# EasyEDA Pro project Sabhya_USB_HUb.epro

# Schematic Schematic1
Board Name: Board1; Create Date: 2026-05-26; Page Name: P1; Project Name: Sabhya_USB_Hub; Schematic Name: Schematic1; Update Date: 2026-05-27; Company: EasyEDA.com; Page Size: A4; Version: V1.0
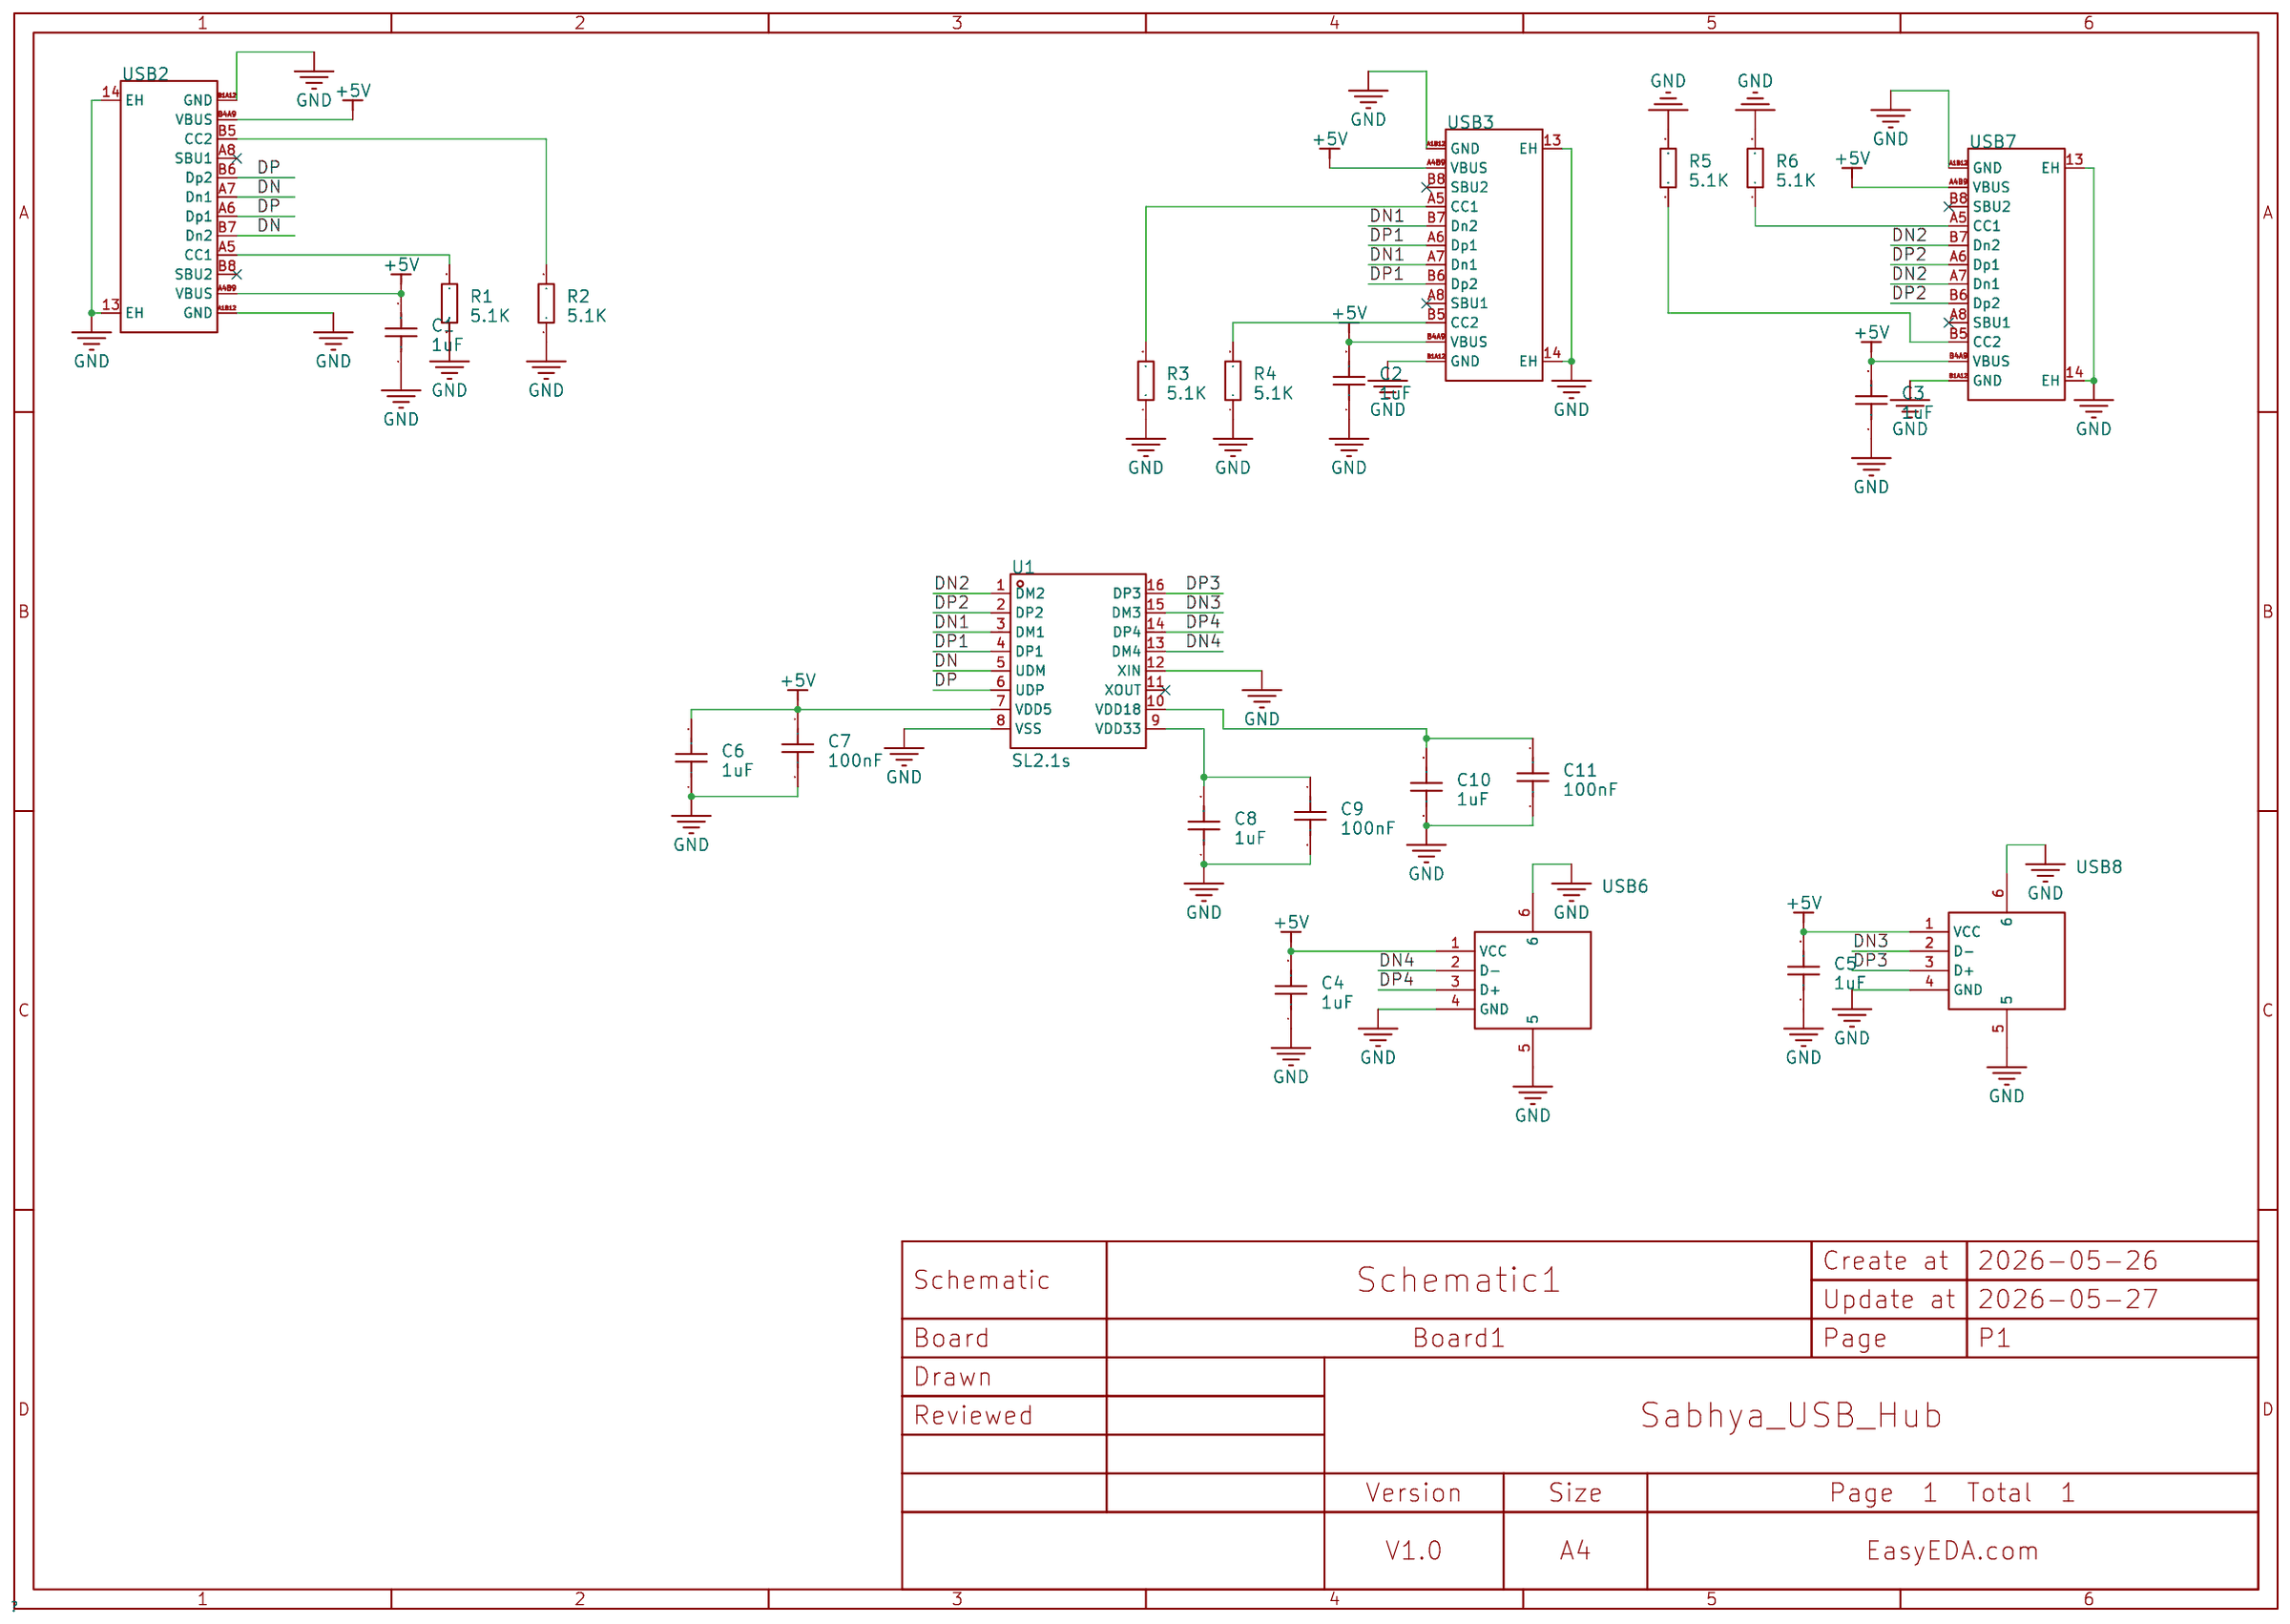
[diagram p0: schematic sheet]

## Parts
C1  1uF  [C0603]
C2  1uF  [C0603]
C3  1uF  [C0603]
C4  1uF  [C0603]
C5  1uF  [C0603]
C6  1uF  [C0603]
C7  100nF  [C0603]
C8  1uF  [C0603]
C9  100nF  [C0603]
C10  1uF  [C0603]
C11  100nF  [C0603]
R1  5.1K  [R0603]
R2  5.1K  [R0603]
R3  5.1K  [R0603]
R4  5.1K  [R0603]
R5  5.1K  [R0603]
R6  5.1K  [R0603]
U1  SL2.1s  [SSOP-16_L4.6-W2.6-P0.53-LS4.0-BL]
USB2  TYPE-C 16PIN 2MD(073)  [USB-C-SMD_TYPE-C-16PIN-2MD-073]
USB3  TYPE-C 16PIN 2MD(073)  [USB-C-SMD_TYPE-C-16PIN-2MD-073]
USB6  10.0 QHHTZB6.3  [USB-A-TH_10.0QHHTZB6.3]
USB7  TYPE-C 16PIN 2MD(073)  [USB-C-SMD_TYPE-C-16PIN-2MD-073]
USB8  10.0 QHHTZB6.3  [USB-A-TH_10.0QHHTZB6.3]

## Library data of the parts
C1-C6 C8 C10 = CAP_0603: Supplier Footprint: 0603; LCSC Part Name: 1uF ±10% 50V; Supplier Part: C15849; Manufacturer: SAMSUNG(三星); Manufacturer Part: CL10A105KB8NNNC; JLCPCB Part Class: Basic Part; Datasheet: https://item.szlcsc.com/datasheet/CL10A105KB8NNNC/16531.html; Supplier: LCSC; Tolerance: ±10%; Voltage Rating: 50V; Temperature Coefficient: X5R; PCB Layer: TopLayer
C7 C9 C11 = CAP_0603: Supplier Footprint: 0603; LCSC Part Name: CAPR500-350X720X850100nF100V; Supplier Part: C2927433; Manufacturer Part: CAPR500-350X720X850100nF100V; JLCPCB Part Class: Extended Part; Supplier: LCSC; PCB Layer: TopLayer
R1-R6 = Res_0603: Supplier Footprint: 0603
U1 = SL2.1s: type:Hub USB Protocol:USB 2.0 Data Rate:- Voltage - Supply:4V~5.25V Voltage - Supply:4V~5.25V Operating Temperature:0℃~+70℃ Operating Temperature:0℃~+70℃ Memory Interface:- Current - Supply:120mA Quiescent Supply Current:2.5mA Number of Channels:4; LCSC Part Name: USB2.0 HUB控制器集成电路; Supplier Part: C2684433; Manufacturer: CoreChips(和芯润德); Supplier Footprint: SSOP-16; JLCPCB Part Class: Extended Part; Datasheet: https://item.szlcsc.com/datasheet/SL2.1s/2782346.html; Supplier: LCSC; type: Hub; USB Protocol: USB 2.0; Voltage - Supply: 4V~5.25V; Operating Temperature: 0℃~+70℃; Current - Supply: 120mA; Quiescent Supply Current: 2.5mA; Number of Channels: 4
USB2 USB3 USB7 = TYPE-C 16PIN 2MD(073): Connector Type:Type-C Protocol Standard:- Gender:Female Mounting Type:Surface Mount, Right Angle Number of Contacts:16P Number of Ports:1 Current Rating-Power:3A Voltage Rating:5V Connect-Disconnect Life:10,000 Cycles Supplementary Features:- Center Heigh; LCSC Part Name: Type-C 母 卧贴; Supplier Part: C2765186; Manufacturer: SHOU HAN(首韩); Supplier Footprint: SMD; JLCPCB Part Class: Extended Part; Datasheet: https://item.szlcsc.com/datasheet/TYPE-C%252016PIN%25202MD(073)/2901843.html; Supplier: LCSC; Connector Type: Type-C; Gender: Female; Mounting Type: Surface Mount, Right Angle; Number of Contacts: 16P; Number of Ports: 1; Current Rating-Power: 3A; Voltage Rating: 5V; Connect-Disconnect Life: 10,000 Cycles; Detection color: Black; Operating Temperature: -25℃~+85℃
USB6 USB8 = 10.0 QHHTZB6.3: Connector Type:Type-A Protocol Standard:USB 2.0 Gender:Female Mounting Type:Surface Mount, Right Angle Number of Contacts:4P Number of Ports:1 Current Rating-Power:1.5A Voltage Rating:30V Connect-Disconnect Life:5,000 times Supplementary Features:- Center; LCSC Part Name: 壳长10.0mm; Supplier Part: C668591; Manufacturer: SHOU HAN(首韩); Supplier Footprint: SMD; JLCPCB Part Class: Extended Part; Datasheet: https://item.szlcsc.com/datasheet/10.0%2520QHHTZB6.3/698534.html; Supplier: LCSC; Connector Type: Type-A; Protocol Standard: USB 2.0; Gender: Female; Mounting Type: Surface Mount, Right Angle; Number of Contacts: 4P; Number of Ports: 1; Current Rating-Power: 1.5A; Voltage Rating: 30V; Connect-Disconnect Life: 5,000 times; Length: 10mm; Detection color: Black; Operating Temperature: -25℃~+85℃

## Nets
+5V: C1.2 C2.2 C3.2 C4.2 C5.2 C6.2 C7.1 U1.7(VDD5) USB2.A4B9(VBUS) USB2.B4A9(VBUS) USB3.A4B9(VBUS) USB3.B4A9(VBUS) USB6.1(VCC) USB7.A4B9(VBUS) USB7.B4A9(VBUS) USB8.1(VCC)
GND: C1.1 C2.1 C3.1 C4.1 C5.1 C6.1 C7.2 C8.1 C9.2 C10.1 C11.2 R1.1 R2.1 R3.1 R4.1 R5.2 R6.2 U1.8(VSS) U1.12(XIN) USB2.13(EH) USB2.14(EH) USB2.A1B12(GND) USB2.B1A12(GND) USB3.13(EH) USB3.14(EH) USB3.A1B12(GND) USB3.B1A12(GND) USB6.4(GND) USB6.5 USB6.6 USB7.13(EH) USB7.14(EH) USB7.A1B12(GND) USB7.B1A12(GND) USB8.4(GND) USB8.5 USB8.6
DN: U1.5(UDM) USB2.A7(Dn1) USB2.B7(Dn2)
DN1: U1.3(DM1) USB3.A7(Dn1) USB3.B7(Dn2)
DN2: U1.1(DM2) USB7.A7(Dn1) USB7.B7(Dn2)
DN3: U1.15(DM3) USB8.2(D-)
DN4: U1.13(DM4) USB6.2(D-)
DP: U1.6(UDP) USB2.A6(Dp1) USB2.B6(Dp2)
DP1: U1.4(DP1) USB3.A6(Dp1) USB3.B6(Dp2)
DP2: U1.2(DP2) USB7.A6(Dp1) USB7.B6(Dp2)
DP3: U1.16(DP3) USB8.3(D+)
DP4: U1.14(DP4) USB6.3(D+)
$1N1488: R1.2 USB2.A5(CC1)
$1N1504: R2.2 USB2.B5(CC2)
$1N2566: R5.1 USB7.B5(CC2)
$1N2571: R6.1 USB7.A5(CC1)
$1N3207: C8.2 C9.1 U1.9(VDD33)
$1N3292: C10.2 C11.1 U1.10(VDD18)
$1N3299: R4.2 USB3.B5(CC2)
$1N3300: R3.2 USB3.A5(CC1)

Not connected (* = marked no-connect by the designer): U1 11(XOUT)*; USB2 A8(SBU1)* B8(SBU2)*; USB3 A8(SBU1)* B8(SBU2)*; USB7 A8(SBU1)* B8(SBU2)*

# Board PCB1
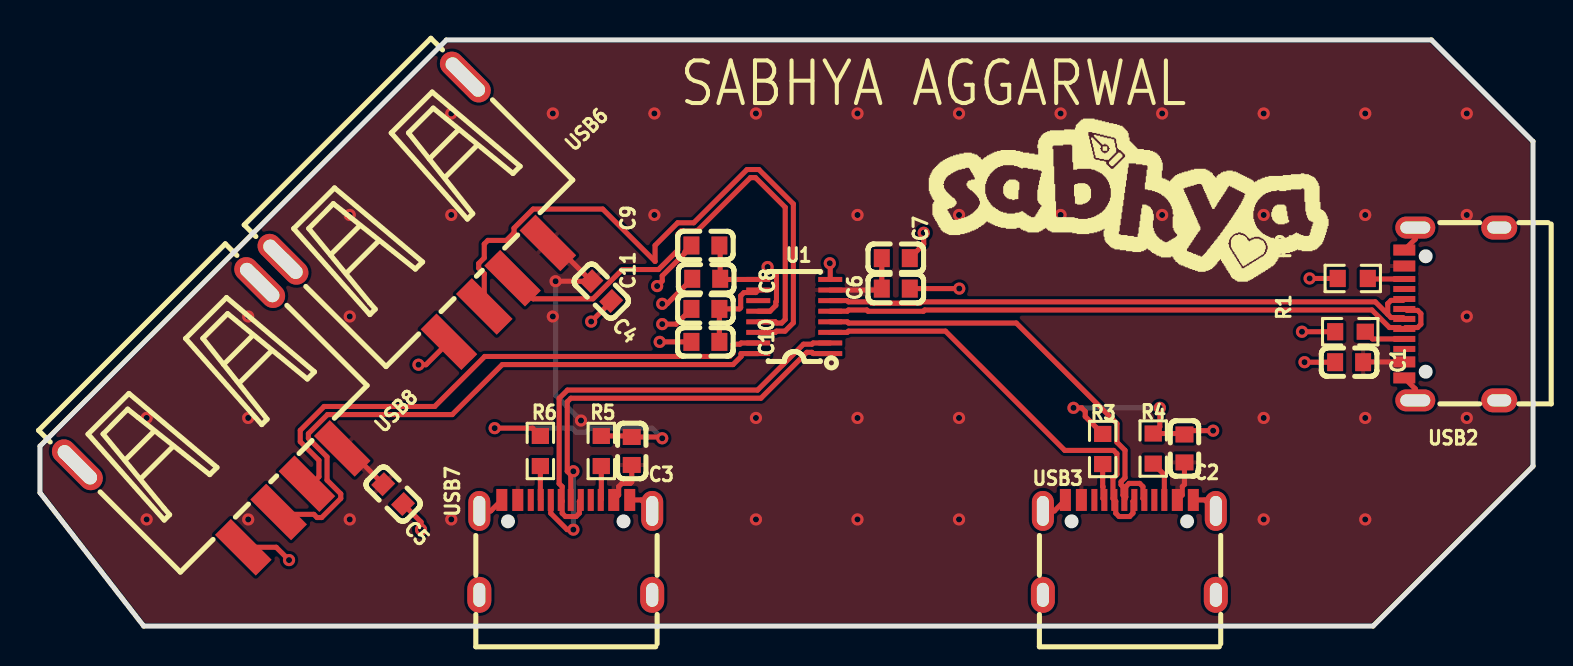
[diagram p1: board, top side]
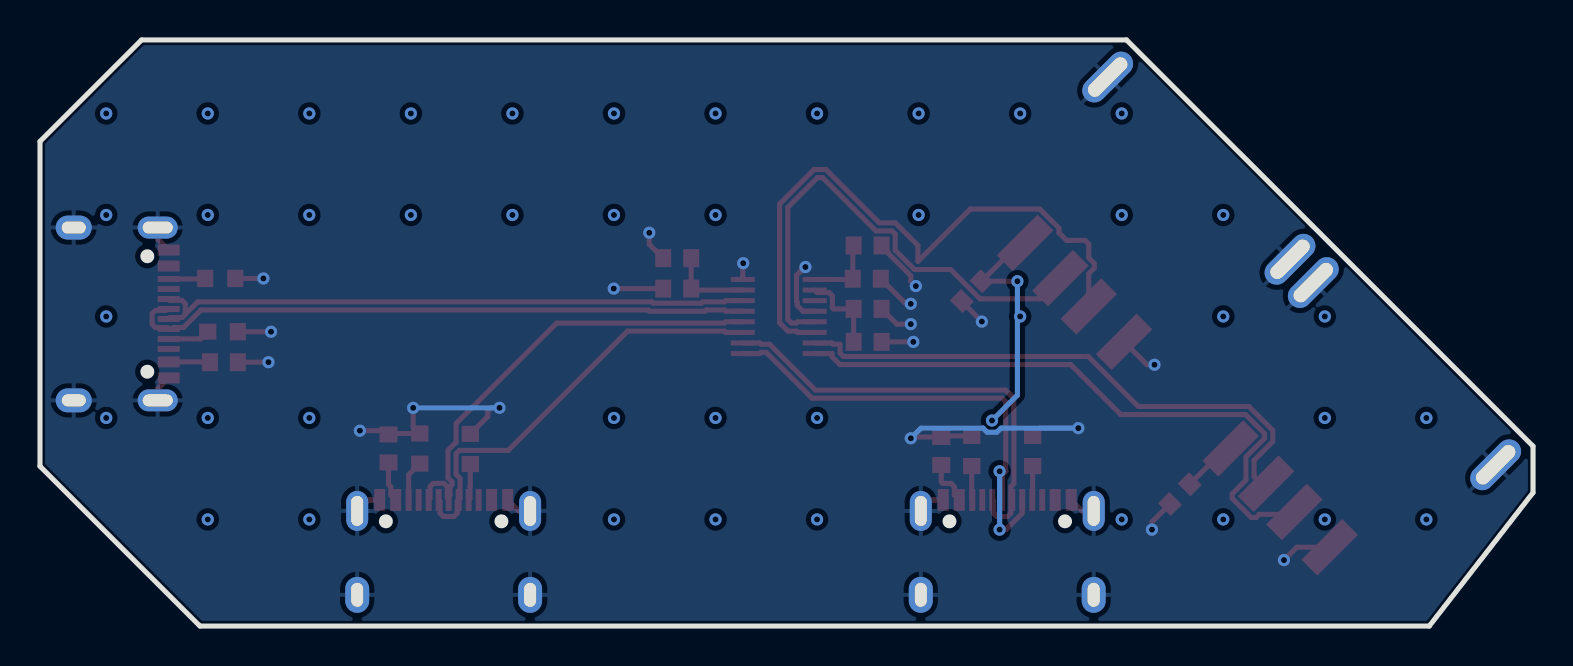
[diagram p2: board, bottom side, seen from below]

Outline 74.69 x 29.34 mm; copper layers: Top Layer, Bottom Layer. Coordinates in mm from the lower left corner of the outline.
Outline path: 0,9 0,6.68 5.19,0 66.69,0 74.69,8 74.69,24.26 69.61,29.34 20.33,29.34 0,9
Stack: Top Layer 0.035mm / Dielectric1 1.51mm FR4 er 4.5 / Bottom Layer 0.035mm

## Design rules (mm)
net DN2: DP3
net DP2: DP3
net DN1: DP2
net DP1: DP2
net DN: DP1
net DP: DP1
net DN4: DP5
net DP4: DP5
net DN3: DP4
net DP3: DP4
spacing copperThickness1oz (default): track to track 0.102, other pairs 0.152 to 0.3
spacing copperThickness2oz: track to track 0.203, other pairs 0.152 to 0.3
spacing Plane_innerPlane: track to track 0.102, other pairs 0.152 to 0.3
spacing Copper_copperRegion: track to track 0.102, other pairs 0.152 to 0.3
track width copperThickness1oz (default): min 0.127, default 0.254, max 2.54
track width copperThickness2oz: min 0.203, default 0.254, max 2.54
differential pair differentialPair (default): width min 0.127, default 0.254, max 2.54; gap min 0.152, default 0.152
pour e289 uses Copper_copperRegion
pour e320 uses Copper_copperRegion

## Placement (name value [footprint] x y rotation side)
C1  1uF  [C0603]  65.49 13.21 0 top
C2  1uF  [C0603]  57.25 8.89 270 top
C3  1uF  [C0603]  29.6 8.76 270 top
C4  1uF  [C0603]  28.08 16.76 135 top
C5  1uF  [C0603]  17.67 6.6 135 top
C6  1uF  [C0603]  42.81 16.89 180 top
C7  100nF  [C0603]  42.81 18.41 0 top
C8  1uF  [C0603]  33.33 17.38 0 top
C9  100nF  [C0603]  33.29 19.05 180 top
C10  1uF  [C0603]  33.29 14.22 0 top
C11  100nF  [C0603]  33.29 15.88 180 top
R1  5.1K  [R0603#2]  65.55 14.73 0 top
R2  5.1K  [R0603]  65.67 17.4 0 top
R3  5.1K  [R0603]  53.16 8.86 270 top
R4  5.1K  [R0603]  55.69 8.88 270 top
R5  5.1K  [R0603]  28.08 8.76 90 top
R6  5.1K  [R0603]  25.03 8.76 90 top
U1  SL2.1s  [SSOP-16_L4.6-W2.6-P0.53-LS4.0-BL]  37.73 15.49 90 top
USB2  TYPE-C 16PIN 2MD(073)  [USB-C-SMD_TYPE-C-16PIN-2MD-073]  70.63 15.62 90 top
USB3  TYPE-C 16PIN 2MD(073)  [USB-C-SMD_TYPE-C-16PIN-2MD-073]  54.5 3.94 0 top
USB6  10.0 QHHTZB6.3  [USB-A-TH_10.0QHHTZB6.3]  19.83 19.81 225 top
USB7  TYPE-C 16PIN 2MD(073)  [USB-C-SMD_TYPE-C-16PIN-2MD-073]  26.3 3.94 0 top
USB8  10.0 QHHTZB6.3  [USB-A-TH_10.0QHHTZB6.3]  9.54 9.52 225 top

## Footprints (pads in the part's own frame, mm; a bottom-side part is the same pattern mirrored in y, then rotated)
C0603
  rect 0.8x0.9 smd: 1(-0.7,0) 2(0.7,0)
R0603
  rect 0.806x0.864 smd: 1(-0.753,0) 2(0.753,0)
R0603#2
  rect 0.806x0.864 smd: 1(-0.753,0)
  rect 0.864x0.806 smd: 2(0.753,0)
SSOP-16_L4.6-W2.6-P0.53-LS4.0-BL
  rect 0.25x1.2 smd: 1(-1.855,-1.8) 2(-1.325,-1.8) 3(-0.795,-1.8) 4(-0.265,-1.8) 5(0.265,-1.8) 6(0.795,-1.8) 7(1.325,-1.8) 8(1.855,-1.8) 9(1.855,1.8) 10(1.325,1.8) 11(0.795,1.8) 12(0.265,1.8) 13(-0.265,1.8) 14(-0.795,1.8) 15(-1.325,1.8) 16(-1.855,1.8)
USB-A-TH_10.0QHHTZB6.3
  rect 1.12x2.88 smd: 1(-3.5,4.395) 2(-1,4.395) 3(1,4.395) 4(3.5,4.395)
  oval 1.2x3.1 hole 0.7x2.5: 5(-6.45,-4.395) 6(6.45,-4.395)
USB-C-SMD_TYPE-C-16PIN-2MD-073
  oval 1.1x2 hole 0.6x1.5: 13(-4.325,1.825) 14(4.325,1.825)
  oval 1.2x1.8 hole 0.6x1.2: 13(-4.325,-2.375) 14(4.325,-2.375)
  rect 0.55x1.1 smd: A1B12(-3.2,2.375) A4B9(-2.4,2.375) B1A12(3.2,2.375) B4A9(2.4,2.375)
  rect 0.3x1.1 smd: A5(-1.25,2.375) A6(-0.25,2.375) A7(0.25,2.375) A8(1.25,2.375) B5(1.75,2.375) B6(0.75,2.375) B7(-0.75,2.375) B8(-1.75,2.375)

## Nets
As in the schematic.

Pads without a net: U1 11; USB2 A8 B8; USB3 A8 B8; USB7 A8 B8

## Via types
v1: diameter 0.61, hole 0.305, Top Layer to Bottom Layer, 66 vias

## Routing (per net, layer and track width the routed paths; a pad name or vN(x,y) marks a point on that pad's centre or on a via; arc(x,y) is an arc through that point)
+5V: length 25.7
  Top Layer w0.254: USB2.A4B9 66.2,13.22 C1.2 ; USB7.B4A9 28.95,6.56 28.95,6.98 29.11,7.14 29.53,7.14 29.6,7.21 C3.2 ; USB6.1 25.67,19.18 27.59,17.26 v1(25.79,17.26) ; 15.12,8.89 15.38,8.89 C5.2 ; USB3.B4A9 57.14,6.56 57.14,6.98 57.25,7.09 C2.2 ; U1.7 42.04,16.82 C6.2 C7.1
  Bottom Layer w0.254: v1(25.79,17.26) 25.79,11.56 v1(27.06,10.29)
  vias: v1(5.34,10.42) v1(5.34,5.34) v1(10.42,15.5) v1(10.42,10.42) v1(10.42,5.34) v1(15.5,20.58) v1(15.5,15.5) v1(15.5,5.34) v1(20.58,25.66) v1(20.58,20.58) v1(20.58,5.34) v1(25.66,25.66) v1(25.66,15.5) v1(30.74,25.66) v1(30.74,20.58) v1(35.82,25.66) v1(35.82,10.42) v1(35.82,5.34) v1(40.9,25.66) v1(40.9,20.58) v1(40.9,10.42) v1(40.9,5.34) v1(45.98,25.66) v1(45.98,20.58) v1(45.98,10.42) v1(45.98,5.34) v1(51.06,25.66) v1(51.06,20.58) v1(56.14,25.66) v1(56.14,20.58) v1(61.22,25.66) v1(61.22,20.58) v1(61.22,10.42) v1(61.22,5.34) v1(66.3,25.66) v1(66.3,20.58) v1(66.3,10.42) v1(66.3,5.34) v1(71.38,25.66) v1(71.38,20.58) v1(71.38,15.5) v1(71.38,10.42)
GND: length 61.8
  Top Layer w0.254: C6.1 v1(45.99,16.89) ; v1(27.57,15.24) 28.58,16.24 28.58,16.27 ; v1(58.69,9.78) 57.44,9.78 C2.1 57.21,9.64 R4.1 56.02,9.97 v1(56.02,10.92) ; R1.1 v1(63.13,14.73) ; C7.2 44.21,19.11 v1(44.21,19.69) ; C8.1 31.37,16.13 v1(31.13,16.13) ; USB2.14 68.8,19.37 USB2.B1A12 ; C9.2 32.26,18.73 32.26,18.67 31.13,17.53 31.13,17.27 v1(30.87,17.02) ; U1.12 36.52,15.76 36.81,16.05 36.81,16.22 36.84,16.26 36.84,17.56 36.65,17.75 36.62,17.75 v1(36.4,17.97) ; USB2.13 68.8,11.87 USB2.A1B12 ; U1.8 39.53,18.14 v1(39.51,18.16) ; USB3.13 50.75,5.76 USB3.A1B12 ; v1(22.75,9.91) 24.64,9.91 R6.2 ; USB3.B1A12 58.27,6.31 USB3.14 ; 10.17,3.94 11.82,3.94 v1(12.46,3.3) ; USB7.14 30.08,6.31 USB7.B1A12 ; USB7.13 22.55,5.76 USB7.A1B12 ; C5.1 19.06,5.21 v1(19.06,4.83) ; R3.1 52.29,10.49 52.29,10.74 52.11,10.92 v1(51.7,10.92) ; R2.1 v1(63.51,17.4) ; C10.1 v1(31,14.22) ; v1(31.13,9.4) 31.06,9.46 C3.1 29.55,9.52 R5.2 ; v1(31.13,15.11) 31.83,15.11 C11.2 ; v1(18.94,13.08) 19.31,13.08 USB6.4 ; C1.1 v1(63.26,13.21)
  Bottom Layer w0.254: v1(31.13,9.4) 30.62,9.91 27.51,9.91 27.31,9.7 26.82,9.7 26.62,9.91 v1(22.75,9.91) ; v1(51.7,10.92) v1(56.02,10.92)
DN: length 31.6
  Top Layer w0.254: USB2.A7 68.27,15.85 68.35,15.85 68.4,15.8 68.92,15.8 69.08,15.64 69.08,15.11 68.92,14.94 68.32,14.94 USB2.B7 68.08,14.87 68.01,14.94 67.51,14.94 66.63,15.82 44.26,15.82 44.2,15.76 41.43,15.76 41.36,15.82 40.45,15.82 40.39,15.76 U1.5
DN1: length 21.7
  Top Layer w0.254: USB3.A7 54.68,6.24 54.68,5.65 54.51,5.48 53.98,5.48 53.82,5.65 53.82,6.24 USB3.B7 53.68,6.38 53.68,7.39 53.87,7.59 53.87,8.63 53.71,8.79 51.27,8.79 45.3,14.76 40.45,14.76 40.39,14.7 U1.3
DN2: length 24.5
  Top Layer w0.254: 26.55,7.57 USB7.A7 ; 26.55,7.57 26.38,7.75 26.38,11.22 26.56,11.4 36.07,11.4 38.36,13.7 38.62,13.7 38.68,13.64 U1.1 ; 26.55,7.57 26.55,7.62 v1(26.68,7.75) ; USB7.B7 25.55,5.64 26.37,4.83 v1(26.68,4.83)
  Bottom Layer w0.254: v1(26.68,4.83) v1(26.68,7.75)
DN3: length 28.4
  Top Layer w0.254: USB8.2 13.61,7.12 13.95,7.47 13.95,8.3 13.02,9.23 13.02,9.8 14.22,10.99 19.75,10.99 22.25,13.49 34.5,13.49 34.67,13.66 34.67,14.11 35.02,14.11 35.08,14.17 U1.15
DN4: length 24.7
  Top Layer w0.254: U1.13 36.79,15.23 36.85,15.17 37.1,15.17 37.28,15.35 37.28,20.96 35.79,22.45 35.54,22.45 32.87,19.78 32.07,19.78 31.91,19.62 31.91,18.81 30.94,17.84 29.13,17.84 27.67,16.38 24.67,16.38 USB6.2
DP: length 30.6
  Top Layer w0.254: 67.42,15.61 67.58,15.44 68.18,15.44 USB2.A6 ; 67.42,15.61 67.42,16.14 67.58,16.3 68.18,16.3 USB2.B6 ; 67.42,15.61 66.8,16.23 44.09,16.23 44.03,16.16 41.6,16.16 41.53,16.23 40.45,16.23 40.39,16.29 U1.6
DP1: length 23
  Top Layer w0.254: USB3.B6 55.18,6.38 55.18,6.98 55.01,7.14 54.48,7.14 54.32,6.98 54.32,6.46 54.27,6.41 54.27,6.33 USB3.A6 54.25,6.48 54.18,6.55 54.18,6.98 54.08,7.07 54.08,7.22 54.28,7.42 54.28,8.8 53.87,9.2 53.87,10.13 48.84,15.17 40.45,15.17 40.39,15.23 U1.4
DP2: length 22.2
  Top Layer w0.254: USB7.B6 26.98,6.24 26.98,5.65 26.82,5.48 26.29,5.48 26.12,5.65 26.12,6.24 USB7.A6 ; U1.2 38.68,14.17 38.62,14.11 38.19,14.11 35.9,11.81 26.39,11.81 25.97,11.39 25.97,7.13 26.12,6.98 26.12,6.31
DP3: length 31.8
  Top Layer w0.254: USB8.3 12.06,5.59 13.7,5.59 13.86,5.43 14.09,5.43 15.05,6.39 15.05,6.62 14.36,7.3 14.36,8.47 13.43,9.4 13.43,9.63 14.38,10.59 20.62,10.59 23.13,13.09 34.67,13.09 35.07,13.49 35.07,13.63 35.08,13.64 U1.16
DP4: length 31.8
  Top Layer w0.254: USB6.3 22.23,17.64 21.95,17.92 21.95,18.15 22.23,18.43 22.23,19.12 22.41,19.3 23.33,19.3 23.71,19.69 23.71,19.92 24.67,20.87 28.15,20.87 30.77,18.25 30.77,19.05 31.9,20.19 32.7,20.19 35.37,22.85 35.96,22.85 37.69,21.13 37.69,15.18 37.27,14.76 36.85,14.76 36.79,14.7 U1.14
$1N1488: length 2.1
  Top Layer w0.254: R1.2 66.66,14.37 USB2.A5
$1N1504: length 1.8
  Top Layer w0.254: R2.2 66.45,17.37 USB2.B5
$1N2566: length 1.7
  Top Layer w0.254: USB7.B5 28.08,6.34 R5.1
$1N2571: length 1.7
  Top Layer w0.254: R6.1 25.03,6.33 USB7.A5
$1N3207: length 3.6
  Top Layer w0.254: C9.1 34.03,19.01 C8.2 34.06,17.35 U1.9
$1N3292: length 4.3
  Top Layer w0.254: U1.10 35.81,16.69 35.22,16.69 35.05,16.53 35.05,15.94 34.99,15.88 C11.1 C10.2
$1N3299: length 2
  Top Layer w0.254: R4.2 56.25,7.57 USB3.B5
$1N3300: length 1.8
  Top Layer w0.254: R3.2 53.16,6.99 53.18,6.98 53.18,6.38 USB3.A5

## Copper pours and planes (outline as drawn; the poured copper is in the pictures)
+5V on Top Layer: -17.77,-30.99 -17.77,41.02 82.94,41.02 82.94,-30.99
GND on Bottom Layer: -2.53,30.86 77.99,30.86 77.99,-2.41 -2.53,-2.41

## Text on the board
Top Silkscreen Layer: SABHYA AGGARWAL
